# Altium schematic sheet Mikroişlemci.SchDoc
size A4; SheetNumber: 2; SheetTotal: 3
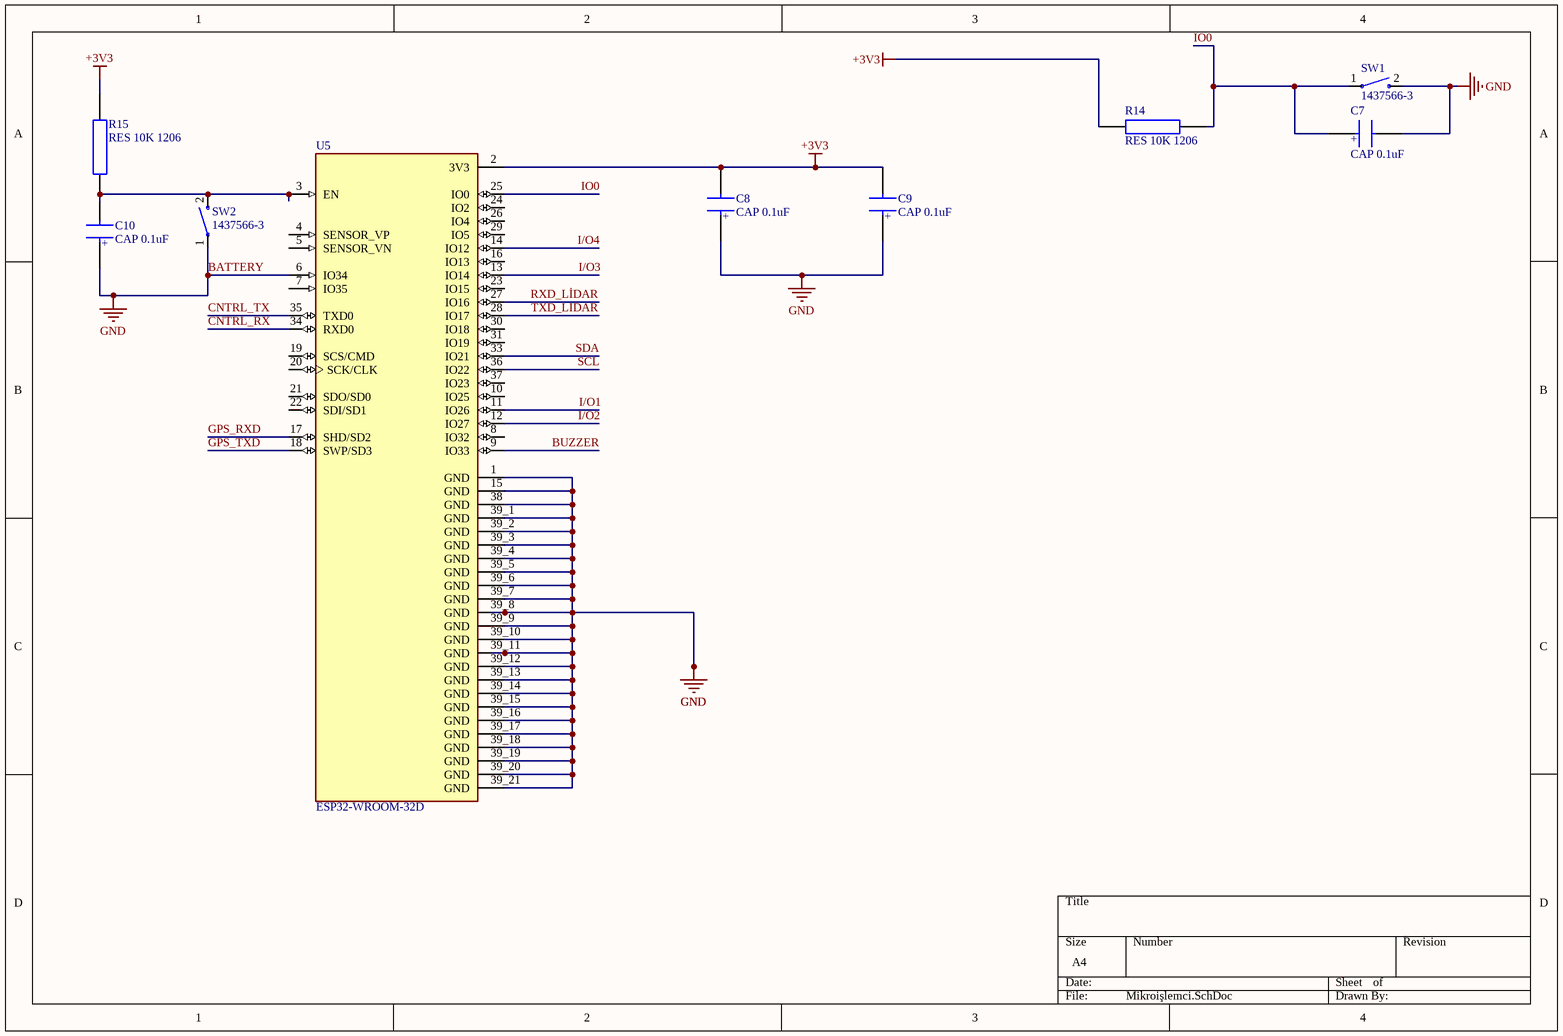
[diagram p0: Mikroişlemci.SchDoc]

## Parts
C7  CAP 0.1uF  [CAP_805]
C8  CAP 0.1uF  [CAP_805]
C9  CAP 0.1uF  [CAP_805]
C10  CAP 0.1uF  [CAP_805]
R14  RES 10K 1206  [RES_1206]
R15  RES 10K 1206  [RES_1206]
SW1  1437566-3  [SW_1437566-3]
SW2  1437566-3  [SW_1437566-3]
U5  ESP32-WROOM-32D  [MODULE_ESP32-WROOM-32D]

## Nets
+3V3: C8.2 C9.2 R14.2 R15.2 U5.2(3V3)
BATTERY: C7.2 C8.1 C9.1 C10.1 SW1.2 SW2.1 U5.1(GND) U5.6(IO34) U5.15(GND) U5.38(GND) U5.39_1(GND) U5.39_2(GND) U5.39_3(GND) U5.39_4(GND) U5.39_5(GND) U5.39_6(GND) U5.39_7(GND) U5.39_8(GND) U5.39_9(GND) U5.39_10(GND) U5.39_11(GND) U5.39_12(GND) U5.39_13(GND) U5.39_14(GND) U5.39_15(GND) U5.39_16(GND) U5.39_17(GND) U5.39_18(GND) U5.39_19(GND) U5.39_20(GND) U5.39_21(GND)  [also labelled GND]
BUZZER: U5.9(IO33)
CNTRL_RX: U5.34(RXD0)
CNTRL_TX: U5.35(TXD0)
GPS_RXD: U5.17(SHD/SD2)
GPS_TXD: U5.18(SWP/SD3)
I/O1: U5.11(IO26)
I/O2: U5.12(IO27)
I/O3: U5.13(IO14)
I/O4: U5.14(IO12)
IO0: C7.1 R14.1 SW1.1 U5.25(IO0)
RXD_LİDAR: U5.27(IO16)
SCL: U5.36(IO22)
SDA: U5.33(IO21)
TXD_LİDAR: U5.28(IO17)
NetC10_2: C10.2 R15.1 SW2.2 U5.3(EN)

Not connected (* = marked no-connect by the designer): U5 4(SENSOR_VP) 5(SENSOR_VN) 7(IO35) 8(IO32) 10(IO25) 16(IO13) 19(SCS/CMD) 20(SCK/CLK) 21(SDO/SD0) 22(SDI/SD1) 23(IO15) 24(IO2) 26(IO4) 29(IO5) 30(IO18) 31(IO19) 37(IO23)

## Notes on the sheet
- (in symbol CAP 1uF) +

## Library data of the parts
C7-C10 = CAP 1uF: 0805 smd
SW1 SW2 = 1437566-3: Switch Tactile OFF (ON) SPST Rectangular Button Gull Wing 0.05A 12VDC SMD Loose Piece; Price: None; Value: *; Package: None; Availability: Unavailable; MP: 1437566-3
U5 = ESP32-WROOM-32D: Bluetooth, WiFi 802.11b/g/n, Bluetooth v4.2 +EDR, Class 1, 2 and 3 Transceiver Module 2.4GHz ~ 2.5GHz Integrated; MF: Espressif Systems; Price: None; Availability: In Stock; Package: Module Espressif Systems; MP: ESP32-WROOM-32D; Value: *; SnapEDA_Link: https://www.snapeda.com/parts/ESP32-WROOM-32D/Espressif+Systems/view-part/?ref=snap; Purchase-URL: https://pricing.snapeda.com/search/part/ESP32-WROOM-32D/?ref=eda; Check_prices: https://www.snapeda.com/parts/ESP32-WROOM-32D/Espressif+Systems/view-part/?ref=eda